# Altium schematic sheet Sheet1_v3.SchDoc
size A4; SheetNumber: 1; SheetTotal: 1
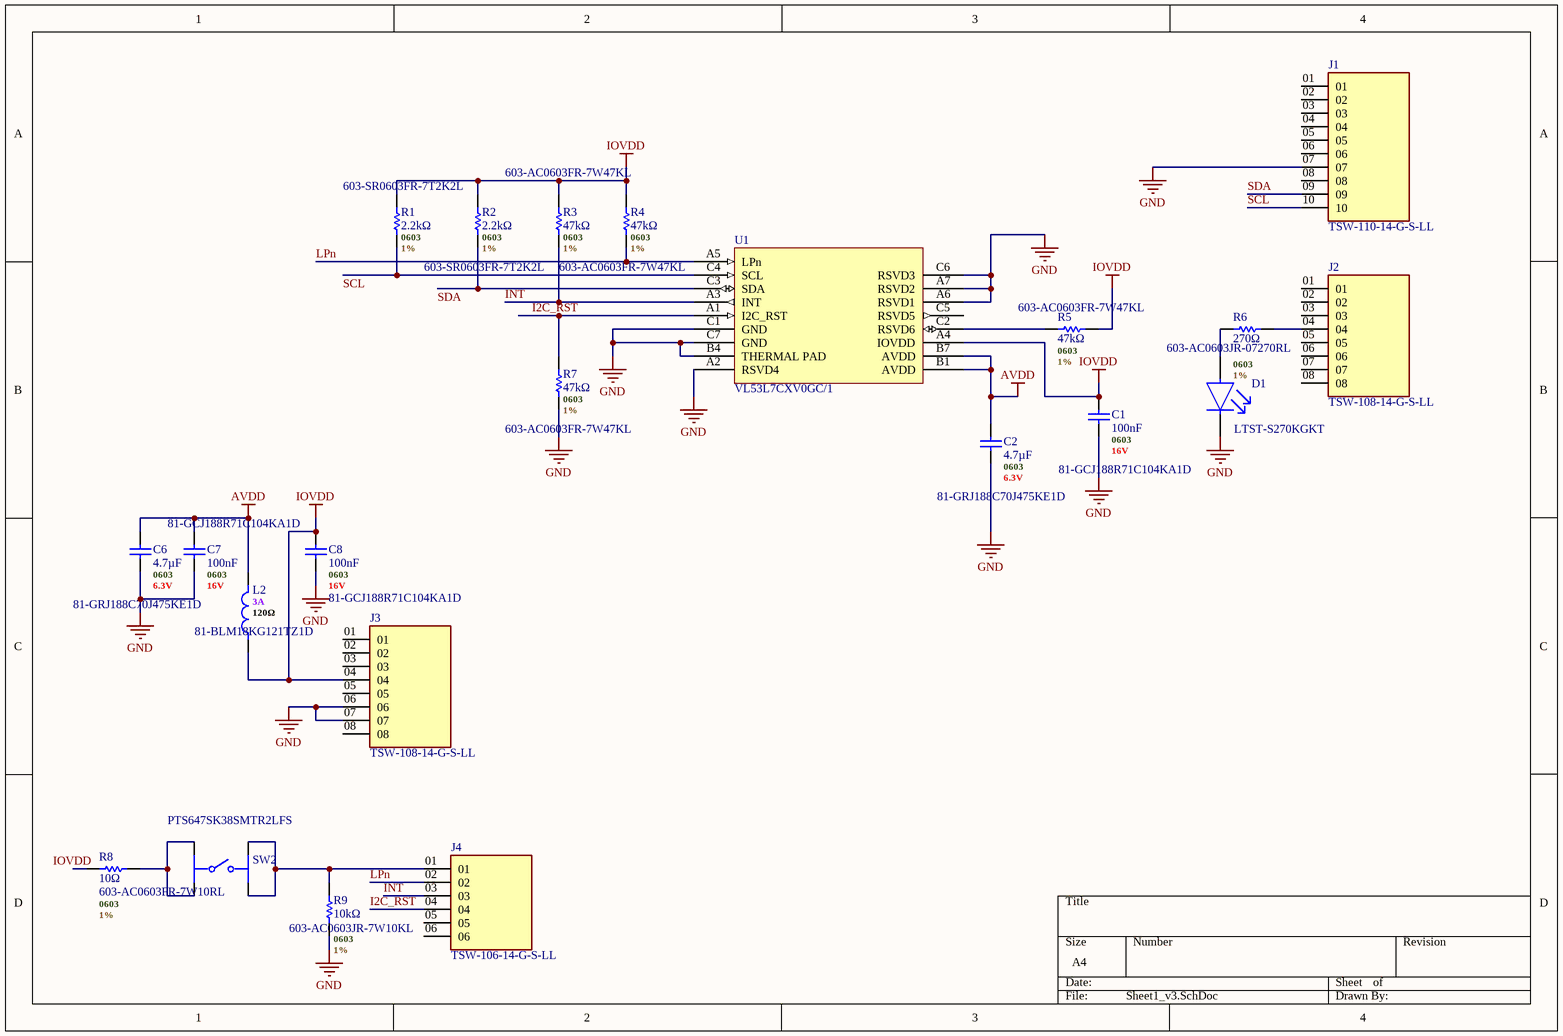
[diagram p0: Sheet1_v3.SchDoc]

## Parts
C1  100nF  .Case/Package: 0603  .Voltage Rating (DC): 16V  Supplier Part Number 1: 81-GCJ188R71C104KA1D  [C0603 - MURATA]
C2  4.7µF  .Case/Package: 0603  .Voltage Rating (DC): 6.3V  Supplier Part Number 1: 81-GRJ188C70J475KE1D  [C0603 - MURATA]
C6  4.7µF  .Case/Package: 0603  .Voltage Rating (DC): 6.3V  Supplier Part Number 1: 81-GRJ188C70J475KE1D  [C0603 - MURATA]
C7  100nF  .Case/Package: 0603  .Voltage Rating (DC): 16V  Supplier Part Number 1: 81-GCJ188R71C104KA1D  [C0603 - MURATA]
C8  100nF  .Case/Package: 0603  .Voltage Rating (DC): 16V  Supplier Part Number 1: 81-GCJ188R71C104KA1D  [C0603 - MURATA]
D1  LTST-S270KGKT  [FP-LTST-S270KGKT-MFG]
J1  TSW-110-14-G-S-LL  [SAMTEC_TSW-110-14-G-S-LL]
J2  TSW-108-14-G-S-LL  [SAMTEC_TSW-108-14-G-S-LL]
J3  TSW-108-14-G-S-LL  [SAMTEC_TSW-108-14-G-S-LL]
J4  TSW-106-14-G-S-LL  [SAMTEC_TSW-106-14-G-S-LL]
L2  .RMS Current (Irms): 3A  .Value: 120Ω  Supplier Part Number 1: 81-BLM18KG121TZ1D  [BLM18KG121TZ1D]  (hidden comment: BLM18KG121TZ1D)
R1  2.2kΩ  .Case/Package: 0603  .Tolerance: 1%  Supplier Part Number 1: 603-SR0603FR-7T2K2L  [R0603 - YAGEO]
R2  2.2kΩ  .Case/Package: 0603  .Tolerance: 1%  Supplier Part Number 1: 603-SR0603FR-7T2K2L  [R0603 - YAGEO]
R3  47kΩ  .Case/Package: 0603  .Tolerance: 1%  Supplier Part Number 1: 603-AC0603FR-7W47KL  [R0603 - YAGEO]
R4  47kΩ  .Case/Package: 0603  .Tolerance: 1%  Supplier Part Number 1: 603-AC0603FR-7W47KL  [R0603 - YAGEO]
R5  47kΩ  .Case/Package: 0603  .Tolerance: 1%  Supplier Part Number 1: 603-AC0603FR-7W47KL  [R0603 - YAGEO]
R6  270Ω  Supplier Part Number: 603-AC0603JR-07270RL  .Case/Package: 0603  .Tolerance: 1%  [R0603 - YAGEO]
R7  47kΩ  .Case/Package: 0603  .Tolerance: 1%  Supplier Part Number 1: 603-AC0603FR-7W47KL  [R0603 - YAGEO]
R8  10Ω  Supplier Part Number: 603-AC0603FR-7W10RL  .Case/Package: 0603  .Tolerance: 1%  [R0603 - YAGEO]
R9  10kΩ  Supplier Part Number: 603-AC0603JR-7W10KL  .Case/Package: 0603  .Tolerance: 1%  [R0603 - YAGEO]
SW2  PTS647SK38SMTR2LFS  [FP-PTS647SK38SMTR2LFS-MFG]
U1  VL53L7CXV0GC/1  [VL53L7CXV0GC1]

## Nets
AVDD: C2.2 C6.2 C7.2 L2.2 U1.B1(AVDD) U1.B7(AVDD)
GND: C1.1 C2.1 C6.1 C7.1 C8.1 D1.1(C) J1.07 J3.06 J3.07 R7.1 R9.1 U1.A2(RSVD4) U1.A6(RSVD1) U1.A7(RSVD2) U1.B4(THERMAL_PAD) U1.C1(GND) U1.C6(RSVD3) U1.C7(GND)
IOVDD: C1.2 C8.2 J3.04 L2.1 R1.2 R2.2 R3.2 R4.2 R5.2 R8.1 U1.A4(IOVDD)
I2C_RST: J4.04 R7.2 U1.A1(I2C_RST)
INT: J4.03 R3.1 U1.A3(INT)
LPn: J4.02 R4.1 U1.A5(LPn)
SCL: J1.10 R1.1 U1.C4(SCL)
SDA: J1.09 R2.1 U1.C3(SDA)
NetD1_2: D1.2(A) R6.1
NetJ2_04: J2.04 R6.2
NetJ4_01: J4.01 R9.2 SW2.1 SW2.2
NetR5_1: R5.1 U1.C2(RSVD6)
NetR8_2: R8.2 SW2.3 SW2.4

Not connected (* = marked no-connect by the designer): J1 01 02 03 04 05 06 08; J2 01 02 03 05 06 07 08; J3 01 02 03 05 08; J4 05 06; U1 C5(RSVD5)

## Library data of the parts
C1 C7 C8 = CAP - GENERIC: Ceramic Capacitor, Ceramic, 16V, 10% +Tol, 10% -Tol, X7R, 15% TC, 0.1uF, Surface Mount, 0603; Manufacturer: Murata; Manufacturer Part Number: GCJ188R71C104KA01D; Manufacturer Lifecycle Status: IN PRODUCTION; Supplier 1: Mouser; RoHS: Compliant; Category: Ceramic Capacitors; Stock 1: 83275; Pricing 1: 1=0,16, 10=0,065, 50=0,065, 100=0,054, 1000=0,039, 10000=0,022 (USD); Capacitance: 100nF; Case/Package: 0603; Case Code (Imperial): 0603; Case Code (Metric): 1608; Depth: 800µm; Dielectric: X7R; Dielectric Material: Ceramic; Features: Soft Termination; Height: 800µm; Length: 1.6mm; Lifecycle Status: Production; Material: Ceramic; Max Operating Temperature: 125°C; Min Operating Temperature: -55°C; Mount: Surface Mount; Number of Terminals: 2; Radiation Hardening: No; Ratings: AEC-Q200; REACH SVHC: Yes; Schedule B: 8532240020, 8532240020|8532240020|8532240020|8532240020|8532240020|8532240020|8532240020|8532240020|8532240020|8532240020|8532240020|8532240020|8532240020|8532240020|8532240020|8532240020|8532240020|8532240020|8532240020|8532240020|8532240020|8532240020|8532240020|85; Termination: SMD/SMT; Tolerance: 10%; Voltage Rating: 16V; Voltage Rating (DC): 16V; Width: 800µm; ComponentLink1URL: https://datasheet.octopart.com:443/GCJ188R71C104KA01D-Murata-datasheet-141264586.pdf?src-supplier=Geoflip; ComponentLink1Description: https://datasheet.octopart.com:443/GCJ188R71C104KA01D-Murata-datasheet-141264586.pdf?src-supplier=Geoflip; ComponentLink2URL: https://datasheet.octopart.com:443/GCJ188R71C104KA01D-Murata-datasheet-140654670.pdf?src-supplier=Ciiva; ComponentLink2Description: https://datasheet.octopart.com:443/GCJ188R71C104KA01D-Murata-datasheet-140654670.pdf?src-supplier=Ciiva; ComponentLink3URL: https://datasheet.octopart.com:443/GCJ188R71C104KA01D-Murata-datasheet-138714343.pdf?src-supplier=Ciiva; ComponentLink3Description: https://datasheet.octopart.com:443/GCJ188R71C104KA01D-Murata-datasheet-138714343.pdf?src-supplier=Ciiva; ComponentLink4URL: https://datasheet.octopart.com:443/GCJ188R71C104KA01D-Murata-datasheet-165611796.pdf?src-supplier=TME; ComponentLink4Description: https://datasheet.octopart.com:443/GCJ188R71C104KA01D-Murata-datasheet-165611796.pdf?src-supplier=TME; ComponentLink5URL: https://datasheet.octopart.com:443/GCJ188R71C104KA01D-Murata-datasheet-118179445.pdf?src-supplier=LCSC; ComponentLink5Description: https://datasheet.octopart.com:443/GCJ188R71C104KA01D-Murata-datasheet-118179445.pdf?src-supplier=LCSC; ComponentLink6URL: https://datasheet.octopart.com/GCJ188R71C104KA01D-Murata-datasheet-14405600.pdf; ComponentLink6Description: https://datasheet.octopart.com/GCJ188R71C104KA01D-Murata-datasheet-14405600.pdf; ComponentLink7URL: http://sigma.octopart.com:80/reach_statement/Murata-company-16.pdf?src-supplier=Compliance+Statements; ComponentLink7Description: http://sigma.octopart.com:80/reach_statement/Murata-company-16.pdf?src-supplier=Compliance+Statements
C2 C6 = CAP - GENERIC: GRJ Series 0603 6.3 V 4.7 uF ±10% X7S SMT Multilayer Ceramic Capacitor; Manufacturer: Murata; Manufacturer Part Number: GRJ188C70J475KE11D; Manufacturer Lifecycle Status: IN PRODUCTION; Supplier 1: Mouser; RoHS: Compliant; Category: Ceramic Capacitors; Stock 1: 17220; Pricing 1: 1=0,23, 10=0,096, 50=0,096, 100=0,073, 1000=0,054, 10000=0,042 (USD); Capacitance: 4.7µF; Case/Package: 0603; Case Code (Imperial): 0603; Case Code (Metric): 1608; Dielectric: X7S; Dielectric Material: Ceramic; Features: Soft Termination; Height: 800µm; Length: 1.6mm; Lifecycle Status: Production; Max Operating Temperature: 125°C; Min Operating Temperature: -55°C; Mount: Surface Mount; Number of Terminals: 2; REACH SVHC: Yes; Schedule B: 8532240020, 8532240020|8532240020, 8532240020|8532240020|8532240020, 8532240020|8532240020|8532240020|8532240020; Thickness: 800µm; Tolerance: 10%; Voltage Rating: 6.3V; Voltage Rating (DC): 6.3V; Width: 800µm; ComponentLink1URL: https://datasheet.octopart.com:443/GRJ188C70J475KE11D-Murata-datasheet-165579666.pdf?src-supplier=TME; ComponentLink1Description: https://datasheet.octopart.com:443/GRJ188C70J475KE11D-Murata-datasheet-165579666.pdf?src-supplier=TME; ComponentLink2URL: https://datasheet.octopart.com:443/GRJ188C70J475KE11D-Murata-datasheet-140671071.pdf?src-supplier=Ciiva; ComponentLink2Description: https://datasheet.octopart.com:443/GRJ188C70J475KE11D-Murata-datasheet-140671071.pdf?src-supplier=Ciiva; ComponentLink3URL: https://datasheet.octopart.com:443/GRJ188C70J475KE11D-Murata-datasheet-140671041.pdf?src-supplier=Ciiva; ComponentLink3Description: https://datasheet.octopart.com:443/GRJ188C70J475KE11D-Murata-datasheet-140671041.pdf?src-supplier=Ciiva; ComponentLink4URL: https://datasheet.octopart.com:443/GRJ188C70J475KE11D-Murata-datasheet-138730632.pdf?src-supplier=Ciiva; ComponentLink4Description: https://datasheet.octopart.com:443/GRJ188C70J475KE11D-Murata-datasheet-138730632.pdf?src-supplier=Ciiva; ComponentLink5URL: https://datasheet.octopart.com:443/GRJ188C70J475KE11D-Murata-datasheet-82944415.pdf?src-supplier=Future+Electronics; ComponentLink5Description: https://datasheet.octopart.com:443/GRJ188C70J475KE11D-Murata-datasheet-82944415.pdf?src-supplier=Future+Electronics; ComponentLink6URL: https://datasheet.octopart.com/GRJ188C70J475KE11D-Murata-datasheet-12515295.pdf; ComponentLink6Description: https://datasheet.octopart.com/GRJ188C70J475KE11D-Murata-datasheet-12515295.pdf; ComponentLink7URL: https://datasheet.octopart.com/GRJ188C70J475KE11D-Murata-datasheet-12510076.pdf; ComponentLink7Description: https://datasheet.octopart.com/GRJ188C70J475KE11D-Murata-datasheet-12510076.pdf; ComponentLink8URL: https://datasheet.octopart.com/GRJ188C70J475KE11D-Murata-datasheet-11978611.pdf; ComponentLink8Description: https://datasheet.octopart.com/GRJ188C70J475KE11D-Murata-datasheet-11978611.pdf; ComponentLink9URL: https://datasheet.octopart.com/GRJ188C70J475KE11D-Murata-datasheet-10025737.pdf; ComponentLink9Description: https://datasheet.octopart.com/GRJ188C70J475KE11D-Murata-datasheet-10025737.pdf; ComponentLink10URL: https://datasheet.octopart.com/GRJ188C70J475KE11D-Murata-datasheet-8819587.pdf; ComponentLink10Description: https://datasheet.octopart.com/GRJ188C70J475KE11D-Murata-datasheet-8819587.pdf; ComponentLink11URL: https://datasheet.octopart.com:443/GRJ188C70J475KE11D-Murata-datasheet-142295902.pdf?src-supplier=Arrow.cn; ComponentLink11Description: https://datasheet.octopart.com:443/GRJ188C70J475KE11D-Murata-datasheet-142295902.pdf?src-supplier=Arrow.cn; ComponentLink12URL: http://sigma.octopart.com:80/reach_statement/Murata-company-16.pdf?src-supplier=Compliance+Statements; ComponentLink12Description: http://sigma.octopart.com:80/reach_statement/Murata-company-16.pdf?src-supplier=Compliance+Statements
D1 = CMP-2000-06629-2: LED GREEN CLEAR CHIP SMD R/A; Luminous Intensity: 71mcd; Test Current: 20mA; Dominant Wavelength: 571nm; Lens Style: Diffused; Forward Voltage: 2V; Reverse Voltage: 5V; Wavelength: 574nm; Power Rating: 75mW; Viewing Angle: 130°; Number of Elements: 1; Forward Current: 30mA; Lens Color: Colorless; Package Quantity: 1; Lead Free: Lead Free; Case Code (Imperial): 0603; Lens Transparency: Clear; Width: 1.15mm; Case Code (Metric): 1608; Packaging: Tape and Reel; Depth: 0.6mm; Radiation Hardening: No; Color: Green; Max Operating Temperature: 85°C; Case/Package: 0603; Min Operating Temperature: -55°C; Number of LEDs: 1; Power Dissipation: 75mW; Illumination Color: Green; Number of Pins: 2; Height: 0.6mm; Mount: Surface Mount; Length: 1.6mm
L2 = INDUCTOR_BLM18KG121TZ1D: Ferrite Beads Multi-Layer Power 120Ohm 25% 100MHz 3A 0.03Ohm DCR 0603 T/R Automotive AEC-Q200; Manufacturer: Murata; Current Rating: 1.9A; DC Resistance (DCR): 30mΩ; Number of Circuits: 1; Supplier 1: Mouser; Manufacturer Part Number: BLM18KG121TZ1D; RoHS: Compliant; Category: Ferrite Beads and Chips; Stock 1: 36755; Pricing 1: 1=0,1, 10=0,064, 50=0,05, 100=0,045, 1000=0,027, 10000=0,02 (USD); Case/Package: 0603; Contact Plating: Tin; Core Material: Ferrite; Height: 600µm; Impedance: 120Ω; Length: 1.6mm; Lifecycle Status: Production; Max Operating Temperature: 125°C; Min Operating Temperature: -55°C; Number of Terminals: 2; REACH SVHC: Yes; Resistance: 30mΩ; RMS Current (Irms): 3A; Schedule B: 8504500000, 8504500000|8504500000|8504500000|8504500000|8504500000; Series Resistance: 30mΩ; Test Frequency: 100MHz; Tolerance: 25%; Width: 800µm; ComponentLink1URL: https://datasheet.octopart.com:443/BLM18KG121TZ1D-Murata-datasheet-180806584.pdf?src-supplier=IHS; ComponentLink1Description: https://datasheet.octopart.com:443/BLM18KG121TZ1D-Murata-datasheet-180806584.pdf?src-supplier=IHS; ComponentLink2URL: https://datasheet.octopart.com:443/BLM18KG121TZ1D-Murata-datasheet-141273646.pdf?src-supplier=element14+APAC; ComponentLink2Description: https://datasheet.octopart.com:443/BLM18KG121TZ1D-Murata-datasheet-141273646.pdf?src-supplier=element14+APAC; ComponentLink3URL: https://datasheet.octopart.com:443/BLM18KG121TZ1D-Murata-datasheet-166171476.pdf?src-supplier=TME; ComponentLink3Description: https://datasheet.octopart.com:443/BLM18KG121TZ1D-Murata-datasheet-166171476.pdf?src-supplier=TME; ComponentLink4URL: https://datasheet.octopart.com:443/BLM18KG121TZ1D-Murata-datasheet-138707099.pdf?src-supplier=Ciiva; ComponentLink4Description: https://datasheet.octopart.com:443/BLM18KG121TZ1D-Murata-datasheet-138707099.pdf?src-supplier=Ciiva; ComponentLink5URL: http://sigma.octopart.com:80/reach_statement/Murata-company-16.pdf?src-supplier=Compliance+Statements; ComponentLink5Description: http://sigma.octopart.com:80/reach_statement/Murata-company-16.pdf?src-supplier=Compliance+Statements; .Max DC Current: =Max DC Current
R1 R2 = RESISTOR - GENERIC: Surge Chip Resistor Automotive Grade Thick Film 0603 2.2kOhm 1% Paper T/R; Manufacturer: Yageo Group; Manufacturer Part Number: SR0603FR-7T2K2L; Power Dissipation: 250mW; Temperature Coefficient: 100ppm/°C; Voltage Rating: 75V; Working Voltage: 150V; Supplier 1: Mouser; RoHS: Compliant; Category: Chip SMD Resistors; Stock 1: 5934; Pricing 1: 1=0,55, 10=0,321, 50=0,296, 100=0,265, 1000=0,176, 10000=0,158 (USD); Case/Package: 0603; China RoHS: Non-Compliant; Composition: Thick Film; Height: 450µm; Lifecycle Status: Production; Max Operating Temperature: 155°C; Min Operating Temperature: -55°C; Mount: Surface Mount; Number of Terminals: 2; Packaging: Tape & Reel; Power Rating: 250mW; REACH SVHC: Yes; Resistance: 2.2kΩ; Tolerance: 1%; Width: 800µm; ComponentLink1URL: https://datasheet.octopart.com:443/SR0603FR-7T2K2L-Yageo-datasheet-176402240.pdf?src-supplier=element14+APAC; ComponentLink1Description: https://datasheet.octopart.com:443/SR0603FR-7T2K2L-Yageo-datasheet-176402240.pdf?src-supplier=element14+APAC; ComponentLink2URL: https://datasheet.octopart.com:443/SR0603FR-7T2K2L-Yageo-datasheet-119732217.pdf?src-supplier=Upverter; ComponentLink2Description: https://datasheet.octopart.com:443/SR0603FR-7T2K2L-Yageo-datasheet-119732217.pdf?src-supplier=Upverter; ComponentLink3URL: https://datasheet.octopart.com:443/SR0603FR-7T2K2L-Yageo-datasheet-155675517.pdf?src-supplier=ODG+(Origin+Data+Global); ComponentLink3Description: https://datasheet.octopart.com:443/SR0603FR-7T2K2L-Yageo-datasheet-155675517.pdf?src-supplier=ODG+(Origin+Data+Global); ComponentLink4URL: https://datasheet.octopart.com:443/SR0603FR-7T2K2L-Yageo-datasheet-137701088.pdf?src-supplier=Future+Electronics; ComponentLink4Description: https://datasheet.octopart.com:443/SR0603FR-7T2K2L-Yageo-datasheet-137701088.pdf?src-supplier=Future+Electronics; ComponentLink5URL: https://datasheet.octopart.com/SR0603FR-7T2K2L-Yageo-datasheet-11047080.pdf; ComponentLink5Description: https://datasheet.octopart.com/SR0603FR-7T2K2L-Yageo-datasheet-11047080.pdf; ComponentLink6URL: http://sigma.octopart.com:80/rohs_statement/Yageo-company-2.pdf?src-supplier=Compliance+Statements; ComponentLink6Description: http://sigma.octopart.com:80/rohs_statement/Yageo-company-2.pdf?src-supplier=Compliance+Statements; ComponentLink7URL: http://sigma.octopart.com:80/conflict_mineral_statement/Yageo-company-3.pdf?src-supplier=Compliance+Statements; ComponentLink7Description: http://sigma.octopart.com:80/conflict_mineral_statement/Yageo-company-3.pdf?src-supplier=Compliance+Statements
R3-R5 R7 = RESISTOR - GENERIC: Fixed Resistor, Metal Glaze/thick Film, 0.2W, 47000ohm, 75V, 1% +/-Tol, 100ppm/Cel, Surface Mount, 0603; Manufacturer: Yageo Group; Manufacturer Part Number: AC0603FR-7W47KL; Power Dissipation: 200mW; Temperature Coefficient: 100ppm/°C; Supplier 1: Mouser; RoHS: Compliant; Category: Chip SMD Resistors; Stock 1: 63636; Pricing 1: 1=0,16, 10=0,016, 50=0,016, 100=0,013, 1000=0,013, 10000=0,009 (USD); Case/Package: 0603; China RoHS: Non-Compliant; Composition: Thick Film; Height: 450µm; Lifecycle Status: Production; Max Operating Temperature: 155°C; Min Operating Temperature: -55°C; Mount: Surface Mount; Number of Terminals: 2; Packaging: Tape & Reel; Power Rating: 200mW; REACH SVHC: Yes; Resistance: 47kΩ; Tolerance: 1%; Voltage Rating: 75V; Width: 800µm; Working Voltage: 75V; ComponentLink1URL: https://datasheet.octopart.com:443/AC0603FR-7W47KL-Yageo-datasheet-182189377.pdf?src-supplier=IHS; ComponentLink1Description: https://datasheet.octopart.com:443/AC0603FR-7W47KL-Yageo-datasheet-182189377.pdf?src-supplier=IHS; ComponentLink2URL: https://datasheet.octopart.com:443/AC0603FR-7W47KL-Yageo-datasheet-86786639.pdf?src-supplier=Upverter; ComponentLink2Description: https://datasheet.octopart.com:443/AC0603FR-7W47KL-Yageo-datasheet-86786639.pdf?src-supplier=Upverter; ComponentLink3URL: https://datasheet.octopart.com/AC0603FR-7W47KL-Yageo-datasheet-12512238.pdf; ComponentLink3Description: https://datasheet.octopart.com/AC0603FR-7W47KL-Yageo-datasheet-12512238.pdf; ComponentLink4URL: http://sigma.octopart.com:80/rohs_statement/Yageo-company-2.pdf?src-supplier=Compliance+Statements; ComponentLink4Description: http://sigma.octopart.com:80/rohs_statement/Yageo-company-2.pdf?src-supplier=Compliance+Statements; ComponentLink5URL: http://sigma.octopart.com:80/conflict_mineral_statement/Yageo-company-3.pdf?src-supplier=Compliance+Statements; ComponentLink5Description: http://sigma.octopart.com:80/conflict_mineral_statement/Yageo-company-3.pdf?src-supplier=Compliance+Statements
R6 = RESISTOR - GENERIC: Res Thick Film 0603 270 Ohm 5% 0.1W(1/10W) ±100ppm/C Pad SMD Automotive T/R; Manufacturer: Yageo Group; Manufacturer Part Number: AC0603JR-7W68RL; Power Dissipation: 200mW; Temperature Coefficient: 100ppm/°C; Voltage Rating: 75V; Max Power Dissipation: 100mW; Supplier 1: Mouser; RoHS: Compliant; Category: Chip SMD Resistors; Stock 1: 63636; Pricing 1: 1=0,16, 10=0,016, 50=0,016, 100=0,013, 1000=0,013, 10000=0,009 (USD); Case/Package: 0603; China RoHS: Non-Compliant; Composition: Thick Film; Height: 450µm; Lifecycle Status: Production; Max Operating Temperature: 155°C; Min Operating Temperature: -55°C; Mount: Surface Mount; Number of Terminals: 2; Packaging: Tape & Reel; Power Rating: 200mW; REACH SVHC: Yes; Tolerance: 1%; Width: 800µm; Working Voltage: 75V; ComponentLink4URL: http://sigma.octopart.com:80/rohs_statement/Yageo-company-2.pdf?src-supplier=Compliance+Statements; ComponentLink4Description: http://sigma.octopart.com:80/rohs_statement/Yageo-company-2.pdf?src-supplier=Compliance+Statements; Supplier: DigiKey; Pricing: 5000=0,0055 (USD); Mounting Technology: Surface Mount; ComponentLink6URL: https://datasheet.octopart.com:443/AC0603JR-7W68RL-Yageo-datasheet-182189377.pdf?src-supplier=IHS; ComponentLink6Description: https://datasheet.octopart.com:443/AC0603JR-7W68RL-Yageo-datasheet-182189377.pdf?src-supplier=IHS; ComponentLink7URL: https://datasheet.octopart.com:443/AC0603JR-7W68RL-Yageo-datasheet-86786639.pdf?src-supplier=Upverter; ComponentLink7Description: https://datasheet.octopart.com:443/AC0603JR-7W68RL-Yageo-datasheet-86786639.pdf?src-supplier=Upverter; ComponentLink8URL: https://datasheet.octopart.com/AC0603JR-7W68RL-Yageo-datasheet-12512238.pdf; ComponentLink8Description: https://datasheet.octopart.com/AC0603JR-7W68RL-Yageo-datasheet-12512238.pdf; ComponentLink1URL: https://datasheet.octopart.com:443/AC0603JR-7W68RL-Yageo-datasheet-182189377.pdf?src-supplier=IHS; ComponentLink1Description: https://datasheet.octopart.com:443/AC0603JR-7W68RL-Yageo-datasheet-182189377.pdf?src-supplier=IHS; ComponentLink2URL: https://datasheet.octopart.com:443/AC0603JR-7W68RL-Yageo-datasheet-86786639.pdf?src-supplier=Upverter; ComponentLink2Description: https://datasheet.octopart.com:443/AC0603JR-7W68RL-Yageo-datasheet-86786639.pdf?src-supplier=Upverter; ComponentLink3URL: https://datasheet.octopart.com/AC0603JR-7W68RL-Yageo-datasheet-12512238.pdf; ComponentLink3Description: https://datasheet.octopart.com/AC0603JR-7W68RL-Yageo-datasheet-12512238.pdf; ComponentLink5URL: http://sigma.octopart.com:80/conflict_mineral_statement/Yageo-company-3.pdf?src-supplier=Compliance+Statements; ComponentLink5Description: http://sigma.octopart.com:80/conflict_mineral_statement/Yageo-company-3.pdf?src-supplier=Compliance+Statements; Stock: 26687; ComponentLink9URL: https://datasheet.octopart.com:443/AC0603FR-7W10RL-Yageo-datasheet-182189377.pdf?src-supplier=IHS; ComponentLink9Description: https://datasheet.octopart.com:443/AC0603FR-7W10RL-Yageo-datasheet-182189377.pdf?src-supplier=IHS; ComponentLink10URL: https://datasheet.octopart.com:443/AC0603FR-7W10RL-Yageo-datasheet-86786639.pdf?src-supplier=Upverter; ComponentLink10Description: https://datasheet.octopart.com:443/AC0603FR-7W10RL-Yageo-datasheet-86786639.pdf?src-supplier=Upverter; ComponentLink11URL: https://datasheet.octopart.com/AC0603FR-7W10RL-Yageo-datasheet-12512238.pdf; ComponentLink11Description: https://datasheet.octopart.com/AC0603FR-7W10RL-Yageo-datasheet-12512238.pdf; ComponentLink12URL: https://datasheet.octopart.com:443/AC0603JR-7W10KL-Yageo-datasheet-182189377.pdf?src-supplier=IHS; ComponentLink12Description: https://datasheet.octopart.com:443/AC0603JR-7W10KL-Yageo-datasheet-182189377.pdf?src-supplier=IHS; ComponentLink13URL: https://datasheet.octopart.com:443/AC0603JR-7W10KL-Yageo-datasheet-86786639.pdf?src-supplier=Upverter; ComponentLink13Description: https://datasheet.octopart.com:443/AC0603JR-7W10KL-Yageo-datasheet-86786639.pdf?src-supplier=Upverter; ComponentLink14URL: https://datasheet.octopart.com:443/AC0603JR-7W10KL-Yageo-datasheet-166720450.pdf?src-supplier=Future+Electronics; ComponentLink14Description: https://datasheet.octopart.com:443/AC0603JR-7W10KL-Yageo-datasheet-166720450.pdf?src-supplier=Future+Electronics; ComponentLink15URL: https://datasheet.octopart.com:443/AC0603JR-7W10KL-Yageo-datasheet-151884373.pdf?src-supplier=Future+Electronics; ComponentLink15Description: https://datasheet.octopart.com:443/AC0603JR-7W10KL-Yageo-datasheet-151884373.pdf?src-supplier=Future+Electronics; ComponentLink16URL: https://datasheet.octopart.com:443/AC0603JR-7W10KL-Yageo-datasheet-137699919.pdf?src-supplier=Future+Electronics; ComponentLink16Description: https://datasheet.octopart.com:443/AC0603JR-7W10KL-Yageo-datasheet-137699919.pdf?src-supplier=Future+Electronics; ComponentLink17URL: https://datasheet.octopart.com/AC0603JR-7W10KL-Yageo-datasheet-12512238.pdf; ComponentLink17Description: https://datasheet.octopart.com/AC0603JR-7W10KL-Yageo-datasheet-12512238.pdf; Case Code (Imperial): 0603; Case Code (Metric): 1608; Features: Automotive AEC-Q200, Moisture Resistant; Lead Free: Lead Free; Length: 1.6002mm; Number of Terminations: 2; Resistance: 270Ω; Termination: SMD/SMT; Weight: 2.012816mg; ComponentLink18URL: https://datasheet.octopart.com:443/AC0603JR-07270RL-Yageo-datasheet-182189377.pdf?src-supplier=IHS; ComponentLink18Description: https://datasheet.octopart.com:443/AC0603JR-07270RL-Yageo-datasheet-182189377.pdf?src-supplier=IHS; ComponentLink19URL: https://datasheet.octopart.com:443/AC0603JR-07270RL-Yageo-datasheet-86786639.pdf?src-supplier=Upverter; ComponentLink19Description: https://datasheet.octopart.com:443/AC0603JR-07270RL-Yageo-datasheet-86786639.pdf?src-supplier=Upverter; ComponentLink20URL: https://datasheet.octopart.com:443/AC0603JR-07270RL-Yageo-datasheet-178509465.pdf?src-supplier=Farnell; ComponentLink20Description: https://datasheet.octopart.com:443/AC0603JR-07270RL-Yageo-datasheet-178509465.pdf?src-supplier=Farnell; ComponentLink21URL: https://datasheet.octopart.com/AC0603JR-07270RL-Yageo-datasheet-12512238.pdf; ComponentLink21Description: https://datasheet.octopart.com/AC0603JR-07270RL-Yageo-datasheet-12512238.pdf; ComponentLink22URL: https://datasheet.octopart.com:443/AC0603JR-07270RL-Yageo-datasheet-166720450.pdf?src-supplier=Future+Electronics; ComponentLink22Description: https://datasheet.octopart.com:443/AC0603JR-07270RL-Yageo-datasheet-166720450.pdf?src-supplier=Future+Electronics; ComponentLink23URL: https://datasheet.octopart.com:443/AC0603JR-07270RL-Yageo-datasheet-151884373.pdf?src-supplier=Future+Electronics; ComponentLink23Description: https://datasheet.octopart.com:443/AC0603JR-07270RL-Yageo-datasheet-151884373.pdf?src-supplier=Future+Electronics; ComponentLink24URL: https://datasheet.octopart.com:443/AC0603JR-07270RL-Yageo-datasheet-137699919.pdf?src-supplier=Future+Electronics; ComponentLink24Description: https://datasheet.octopart.com:443/AC0603JR-07270RL-Yageo-datasheet-137699919.pdf?src-supplier=Future+Electronics; ComponentLink25URL: https://datasheet.octopart.com:443/AC0603JR-07270RL-Yageo-datasheet-24580492.pdf?src-supplier=Future+Electronics; ComponentLink25Description: https://datasheet.octopart.com:443/AC0603JR-07270RL-Yageo-datasheet-24580492.pdf?src-supplier=Future+Electronics; ComponentLink26URL: https://datasheet.octopart.com:443/AC0603JR-07270RL-Yageo-datasheet-128680206.pdf?src-supplier=X-ON; ComponentLink26Description: https://datasheet.octopart.com:443/AC0603JR-07270RL-Yageo-datasheet-128680206.pdf?src-supplier=X-ON
R8 = RESISTOR - GENERIC: Fixed Resistor, Metal Glaze/thick Film, 0.2W, 10ohm, 75V, 1% +/-Tol, 100ppm/Cel, Surface Mount, 0603; Manufacturer: Yageo Group; Manufacturer Part Number: AC0603JR-7W68RL; Power Dissipation: 200mW; Temperature Coefficient: 100ppm/°C; Supplier 1: Mouser; RoHS: Compliant; Category: Chip SMD Resistors; Stock 1: 63636; Pricing 1: 1=0,16, 10=0,016, 50=0,016, 100=0,013, 1000=0,013, 10000=0,009 (USD); Case/Package: 0603; China RoHS: Non-Compliant; Composition: Thick Film; Height: 450µm; Lifecycle Status: Production; Max Operating Temperature: 155°C; Min Operating Temperature: -55°C; Mount: Surface Mount; Number of Terminals: 2; Packaging: Tape & Reel; Power Rating: 200mW; REACH SVHC: Yes; Tolerance: 1%; Voltage Rating: 75V; Width: 800µm; Working Voltage: 75V; ComponentLink4URL: http://sigma.octopart.com:80/rohs_statement/Yageo-company-2.pdf?src-supplier=Compliance+Statements; ComponentLink4Description: http://sigma.octopart.com:80/rohs_statement/Yageo-company-2.pdf?src-supplier=Compliance+Statements; Supplier: DigiKey; Pricing: 5000=0,0055 (USD); Mounting Technology: Surface Mount; ComponentLink6URL: https://datasheet.octopart.com:443/AC0603JR-7W68RL-Yageo-datasheet-182189377.pdf?src-supplier=IHS; ComponentLink6Description: https://datasheet.octopart.com:443/AC0603JR-7W68RL-Yageo-datasheet-182189377.pdf?src-supplier=IHS; ComponentLink7URL: https://datasheet.octopart.com:443/AC0603JR-7W68RL-Yageo-datasheet-86786639.pdf?src-supplier=Upverter; ComponentLink7Description: https://datasheet.octopart.com:443/AC0603JR-7W68RL-Yageo-datasheet-86786639.pdf?src-supplier=Upverter; ComponentLink8URL: https://datasheet.octopart.com/AC0603JR-7W68RL-Yageo-datasheet-12512238.pdf; ComponentLink8Description: https://datasheet.octopart.com/AC0603JR-7W68RL-Yageo-datasheet-12512238.pdf; ComponentLink1URL: https://datasheet.octopart.com:443/AC0603JR-7W68RL-Yageo-datasheet-182189377.pdf?src-supplier=IHS; ComponentLink1Description: https://datasheet.octopart.com:443/AC0603JR-7W68RL-Yageo-datasheet-182189377.pdf?src-supplier=IHS; ComponentLink2URL: https://datasheet.octopart.com:443/AC0603JR-7W68RL-Yageo-datasheet-86786639.pdf?src-supplier=Upverter; ComponentLink2Description: https://datasheet.octopart.com:443/AC0603JR-7W68RL-Yageo-datasheet-86786639.pdf?src-supplier=Upverter; ComponentLink3URL: https://datasheet.octopart.com/AC0603JR-7W68RL-Yageo-datasheet-12512238.pdf; ComponentLink3Description: https://datasheet.octopart.com/AC0603JR-7W68RL-Yageo-datasheet-12512238.pdf; ComponentLink5URL: http://sigma.octopart.com:80/conflict_mineral_statement/Yageo-company-3.pdf?src-supplier=Compliance+Statements; ComponentLink5Description: http://sigma.octopart.com:80/conflict_mineral_statement/Yageo-company-3.pdf?src-supplier=Compliance+Statements; Stock: 26687; Resistance: 10Ω; ComponentLink9URL: https://datasheet.octopart.com:443/AC0603FR-7W10RL-Yageo-datasheet-182189377.pdf?src-supplier=IHS; ComponentLink9Description: https://datasheet.octopart.com:443/AC0603FR-7W10RL-Yageo-datasheet-182189377.pdf?src-supplier=IHS; ComponentLink10URL: https://datasheet.octopart.com:443/AC0603FR-7W10RL-Yageo-datasheet-86786639.pdf?src-supplier=Upverter; ComponentLink10Description: https://datasheet.octopart.com:443/AC0603FR-7W10RL-Yageo-datasheet-86786639.pdf?src-supplier=Upverter; ComponentLink11URL: https://datasheet.octopart.com/AC0603FR-7W10RL-Yageo-datasheet-12512238.pdf; ComponentLink11Description: https://datasheet.octopart.com/AC0603FR-7W10RL-Yageo-datasheet-12512238.pdf
R9 = RESISTOR - GENERIC: Fixed Resistor, Metal Glaze/thick Film, 0.2W, 10000ohm, 75V, 5% +/-Tol, 100ppm/Cel, Surface Mount, 0603; Manufacturer: Yageo Group; Manufacturer Part Number: AC0603JR-7W68RL; Power Dissipation: 200mW; Temperature Coefficient: 100ppm/°C; Supplier 1: Mouser; RoHS: Compliant; Category: Chip SMD Resistors; Stock 1: 63636; Pricing 1: 1=0,16, 10=0,016, 50=0,016, 100=0,013, 1000=0,013, 10000=0,009 (USD); Case/Package: 0603; China RoHS: Non-Compliant; Composition: Thick Film; Height: 450µm; Lifecycle Status: Production; Max Operating Temperature: 155°C; Min Operating Temperature: -55°C; Mount: Surface Mount; Number of Terminals: 2; Packaging: Tape & Reel; Power Rating: 200mW; REACH SVHC: Yes; Tolerance: 1%; Voltage Rating: 75V; Width: 800µm; Working Voltage: 75V; ComponentLink4URL: http://sigma.octopart.com:80/rohs_statement/Yageo-company-2.pdf?src-supplier=Compliance+Statements; ComponentLink4Description: http://sigma.octopart.com:80/rohs_statement/Yageo-company-2.pdf?src-supplier=Compliance+Statements; Supplier: DigiKey; Pricing: 5000=0,0055 (USD); Mounting Technology: Surface Mount; ComponentLink6URL: https://datasheet.octopart.com:443/AC0603JR-7W68RL-Yageo-datasheet-182189377.pdf?src-supplier=IHS; ComponentLink6Description: https://datasheet.octopart.com:443/AC0603JR-7W68RL-Yageo-datasheet-182189377.pdf?src-supplier=IHS; ComponentLink7URL: https://datasheet.octopart.com:443/AC0603JR-7W68RL-Yageo-datasheet-86786639.pdf?src-supplier=Upverter; ComponentLink7Description: https://datasheet.octopart.com:443/AC0603JR-7W68RL-Yageo-datasheet-86786639.pdf?src-supplier=Upverter; ComponentLink8URL: https://datasheet.octopart.com/AC0603JR-7W68RL-Yageo-datasheet-12512238.pdf; ComponentLink8Description: https://datasheet.octopart.com/AC0603JR-7W68RL-Yageo-datasheet-12512238.pdf; ComponentLink1URL: https://datasheet.octopart.com:443/AC0603JR-7W68RL-Yageo-datasheet-182189377.pdf?src-supplier=IHS; ComponentLink1Description: https://datasheet.octopart.com:443/AC0603JR-7W68RL-Yageo-datasheet-182189377.pdf?src-supplier=IHS; ComponentLink2URL: https://datasheet.octopart.com:443/AC0603JR-7W68RL-Yageo-datasheet-86786639.pdf?src-supplier=Upverter; ComponentLink2Description: https://datasheet.octopart.com:443/AC0603JR-7W68RL-Yageo-datasheet-86786639.pdf?src-supplier=Upverter; ComponentLink3URL: https://datasheet.octopart.com/AC0603JR-7W68RL-Yageo-datasheet-12512238.pdf; ComponentLink3Description: https://datasheet.octopart.com/AC0603JR-7W68RL-Yageo-datasheet-12512238.pdf; ComponentLink5URL: http://sigma.octopart.com:80/conflict_mineral_statement/Yageo-company-3.pdf?src-supplier=Compliance+Statements; ComponentLink5Description: http://sigma.octopart.com:80/conflict_mineral_statement/Yageo-company-3.pdf?src-supplier=Compliance+Statements; Stock: 26687; ComponentLink9URL: https://datasheet.octopart.com:443/AC0603FR-7W10RL-Yageo-datasheet-182189377.pdf?src-supplier=IHS; ComponentLink9Description: https://datasheet.octopart.com:443/AC0603FR-7W10RL-Yageo-datasheet-182189377.pdf?src-supplier=IHS; ComponentLink10URL: https://datasheet.octopart.com:443/AC0603FR-7W10RL-Yageo-datasheet-86786639.pdf?src-supplier=Upverter; ComponentLink10Description: https://datasheet.octopart.com:443/AC0603FR-7W10RL-Yageo-datasheet-86786639.pdf?src-supplier=Upverter; ComponentLink11URL: https://datasheet.octopart.com/AC0603FR-7W10RL-Yageo-datasheet-12512238.pdf; ComponentLink11Description: https://datasheet.octopart.com/AC0603FR-7W10RL-Yageo-datasheet-12512238.pdf; Resistance: 10kΩ; ComponentLink12URL: https://datasheet.octopart.com:443/AC0603JR-7W10KL-Yageo-datasheet-182189377.pdf?src-supplier=IHS; ComponentLink12Description: https://datasheet.octopart.com:443/AC0603JR-7W10KL-Yageo-datasheet-182189377.pdf?src-supplier=IHS; ComponentLink13URL: https://datasheet.octopart.com:443/AC0603JR-7W10KL-Yageo-datasheet-86786639.pdf?src-supplier=Upverter; ComponentLink13Description: https://datasheet.octopart.com:443/AC0603JR-7W10KL-Yageo-datasheet-86786639.pdf?src-supplier=Upverter; ComponentLink14URL: https://datasheet.octopart.com:443/AC0603JR-7W10KL-Yageo-datasheet-166720450.pdf?src-supplier=Future+Electronics; ComponentLink14Description: https://datasheet.octopart.com:443/AC0603JR-7W10KL-Yageo-datasheet-166720450.pdf?src-supplier=Future+Electronics; ComponentLink15URL: https://datasheet.octopart.com:443/AC0603JR-7W10KL-Yageo-datasheet-151884373.pdf?src-supplier=Future+Electronics; ComponentLink15Description: https://datasheet.octopart.com:443/AC0603JR-7W10KL-Yageo-datasheet-151884373.pdf?src-supplier=Future+Electronics; ComponentLink16URL: https://datasheet.octopart.com:443/AC0603JR-7W10KL-Yageo-datasheet-137699919.pdf?src-supplier=Future+Electronics; ComponentLink16Description: https://datasheet.octopart.com:443/AC0603JR-7W10KL-Yageo-datasheet-137699919.pdf?src-supplier=Future+Electronics; ComponentLink17URL: https://datasheet.octopart.com/AC0603JR-7W10KL-Yageo-datasheet-12512238.pdf; ComponentLink17Description: https://datasheet.octopart.com/AC0603JR-7W10KL-Yageo-datasheet-12512238.pdf
SW2 = CMP-10040-000033-1: TACT 4.5 X 4.5, 3.8 MM H, 2.5N,; Switch Function: Off-Mom; Switch Travel: 0.25mm; Actuator Type: Standard; Illumination Type: Non-Illuminated; Mechanical Life: 100000Cycles; Ratings: IP40; Operating Force: 250gf; Throw Configuration: SPST; Max Operating Temperature: 70°C; Min Operating Temperature: -20°C; Termination: Gull Wing; Mount: Surface Mount; Packaging: Tape and Reel
U1 = VL53L7CXV0GC/1: Proximity Sensor Time of Flight(TOF) 350cm 2.5V to 3.3V/3V to 3.6VDC 16-Pin OPT LGA EP T/R; Manufacturer: STMicroelectronics; Manufacturer Part Number: VL53L8CXV0GC/1; Max Supply Voltage: 1.98V; Min Supply Voltage: 1.62V; Sensing Distance: 4m; Supplier: Mouser; Supplier Part Number: 511-VL53L8CXV0GC/1; RoHS: Compliant; Category: Sensors; Stock: 7156; Pricing: 1=10.39, 10=8.03, 50=7.66, 100=6.65, 1000=5.04, 10000=4.85 (USD); China RoHS: Compliant; Height: 1.75mm; Length: 6.4mm; Lifecycle Status: Production; Max Operating Temperature: 85°C; Min Operating Temperature: -30°C; Mounting Technology: Surface Mount; REACH SVHC: Yes; Supplier 1: Mouser; Supplier Part Number 1: 511-VL53L7CXV0GC/1
J1 = TSW-110-14-G-S-LL: Package: None; Price: None; Value: *; MP: TSW-110-14-G-S-LL; Availability: Unavailable
J2 J3 = TSW-108-14-G-S-LL: Package: None; Price: None; Value: *; MP: TSW-108-14-G-S-LL; Availability: Unavailable
J4 = TSW-106-14-G-S-LL: Package: None; Price: None; Value: *; MP: TSW-106-14-G-S-LL; Availability: Unavailable